# Altium schematic sheet AIM2 - GPS REVB.SchDoc: OEM716 Interface
size B; DrawnBy: DJW; DocumentNumber: 9; SheetNumber: 9; SheetTotal: 12
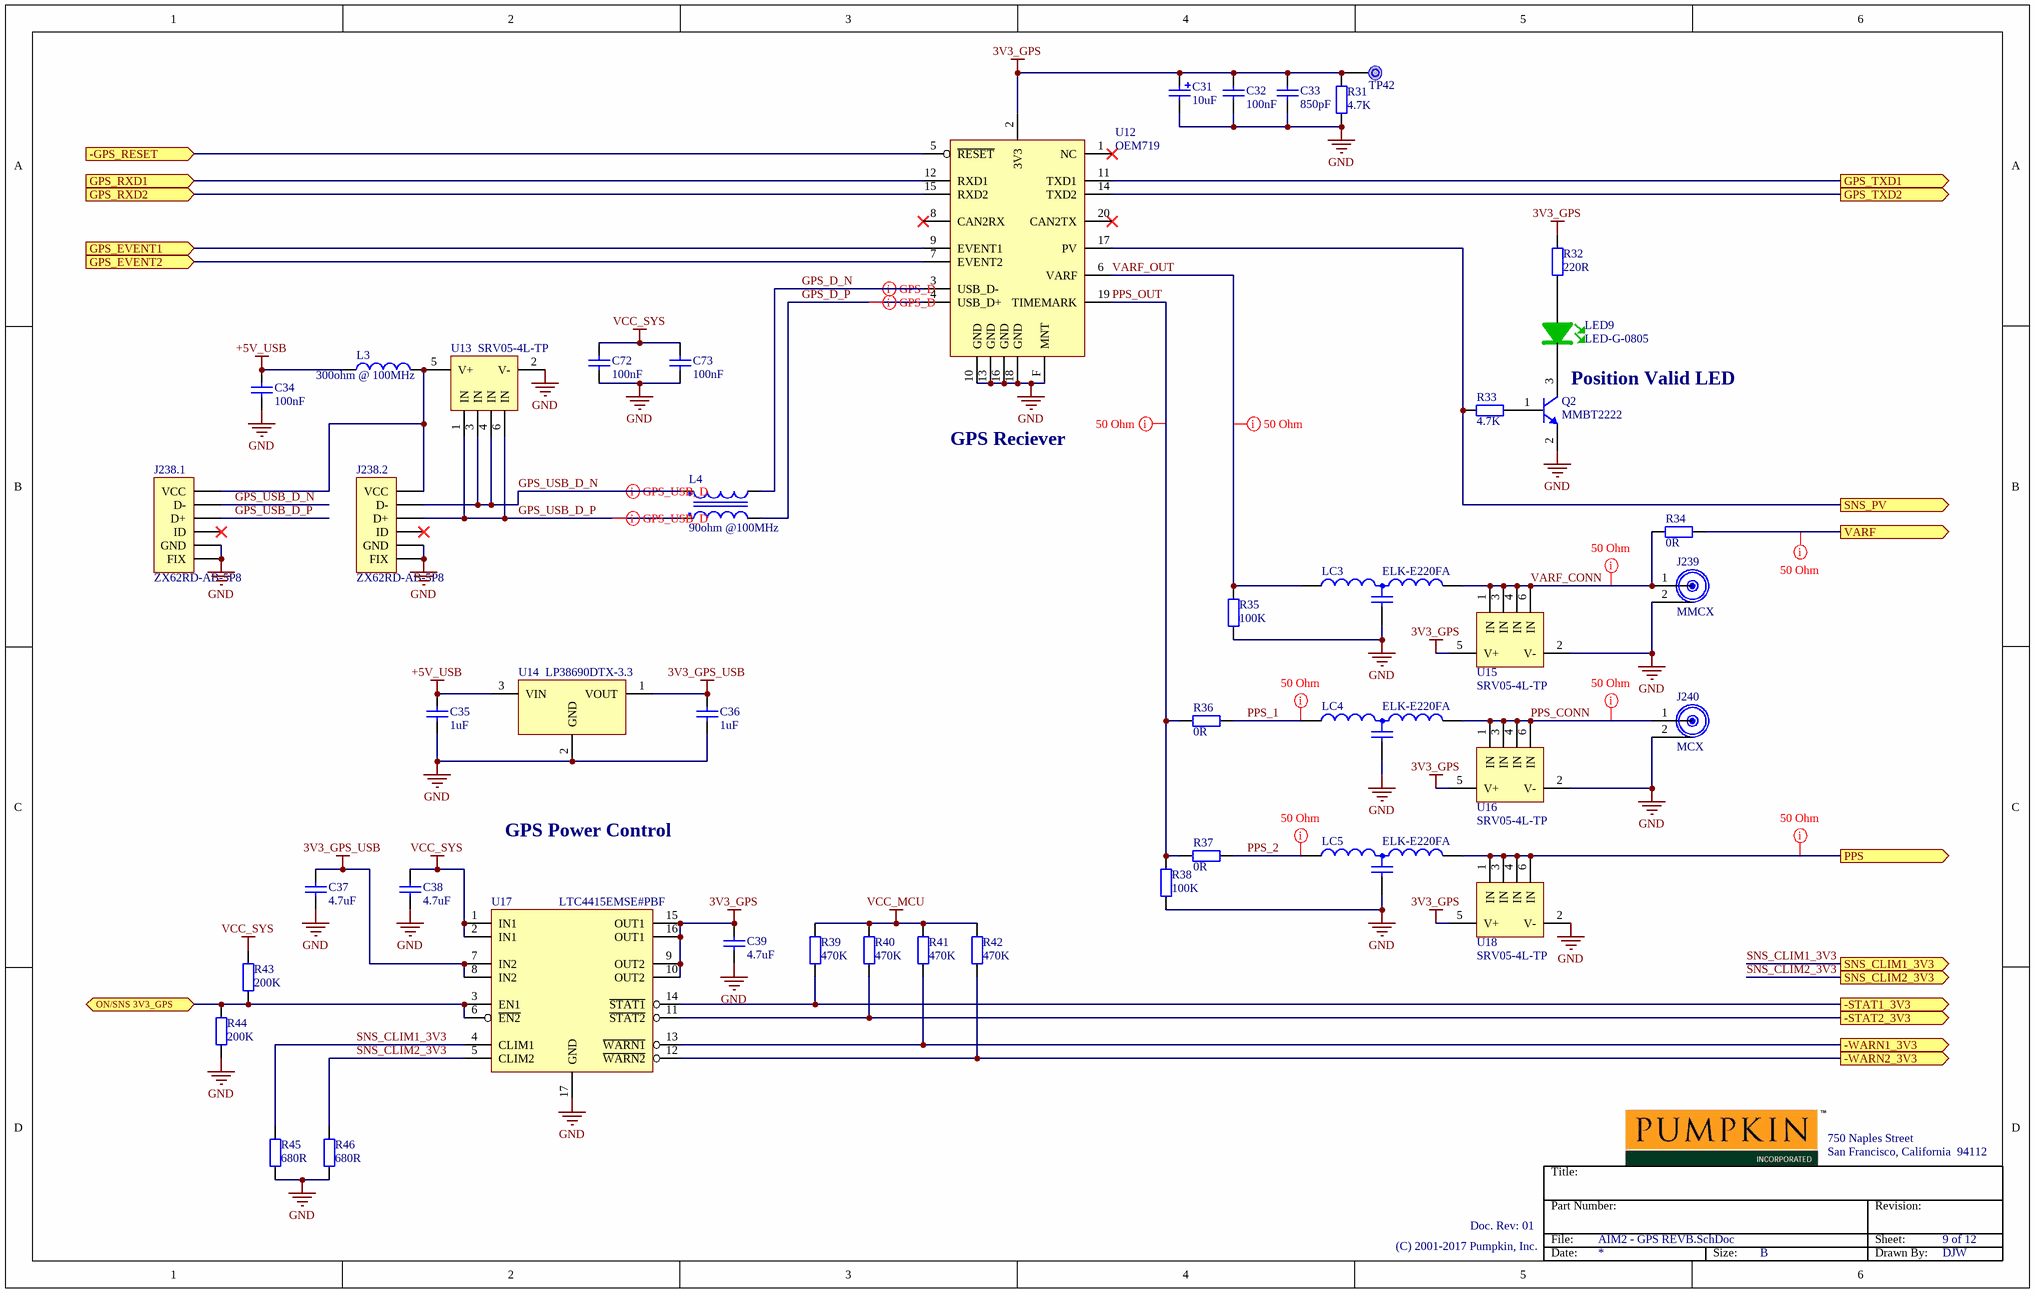
[diagram p0: AIM2 - GPS REVB.SchDoc]

## Parts
C31  10uF  [6032 POLAR CAP]
C32  100nF  [0603 CAP]
C33  850pF  [0603 CAP]
C34  100nF  [0603 CAP]
C35  1uF  [0805 CAP]
C36  1uF  [0805 CAP]
C37  4.7uF  [0805 CAP]
C38  4.7uF  [0805 CAP]
C39  4.7uF  [0805 CAP]
C72  100nF  [0603 CAP]
C73  100nF  [0603 CAP]
J238.1  ZX62RD-AB-5P8  [SM$5C$ZX62RD-AB-5P8]
J238.2  ZX62RD-AB-5P8  [SM$5C$ZX62RD-AB-5P8]
J239  MMCX  [mmcx]
J240  MCX  [MCX]
L3  300ohm @ 100MHz  [0603 IND]
L4  90ohm @100MHz  [DFN250P320X200-4N]
LC3  ELK-E220FA  [ELK]
LC4  ELK-E220FA  [ELK]
LC5  ELK-E220FA  [ELK]
LED9  LED-G-0805  [0805 LED-GREEN]
Q2  MMBT2222  [SOT23-3]
R31  4.7K  [0805 RES]
R32  220R  [0805 RES]
R33  4.7K  [0805 RES]
R34  0R  [0805 RES]
R35  100K  [0805 RES]
R36  0R  [0805 RES]
R37  0R  [0805 RES]
R38  100K  [0805 RES]
R39  470K  [0805 RES]
R40  470K  [0805 RES]
R41  470K  [0805 RES]
R42  470K  [0805 RES]
R43  200K  [0805 RES]
R44  200K  [0805 RES]
R45  680R  [0805 RES]
R46  680R  [0805 RES]
TP42  Testpoint  [Testpoint]  (value not drawn)  (no BOM)
U12  OEM719  [OEM719]
U13  SRV05-4L-TP  [SOT23-6]
U14  LP38690DTX-3.3  [DPAK]
U15  SRV05-4L-TP  [SOT23-6]
U16  SRV05-4L-TP  [SOT23-6]
U17  LTC4415EMSE#PBF  [MSOP-16]
U18  SRV05-4L-TP  [SOT23-6]

## Ports
-GPS_RESET (in), -STAT1_3V3 (out), -STAT2_3V3 (out), -WARN1_3V3 (out), -WARN2_3V3 (out), GPS_EVENT1 (in), GPS_EVENT2 (in), GPS_RXD1 (in), GPS_RXD2 (in), GPS_TXD1 (out), GPS_TXD2 (out), ON/SNS 3V3_GPS (bidir), PPS (out), SNS_CLIM1_3V3 (out), SNS_CLIM2_3V3 (out), SNS_PV (out), VARF (out)

## Nets
3V3_GPS: C31.1 C32.2 C33.2 C39.2 R31.2 R32.2 TP42.1 U12.2(3V3) U15.5(V+) U16.5(V+) U17.9(OUT2) U17.10(OUT2) U17.15(OUT1) U17.16(OUT1) U18.5(V+)
3V3_GPS_USB: C36.2 C37.2 U14.1(VOUT) U17.7(IN2) U17.8(IN2)
+5V_USB: C34.2 C35.2 L3.1 U14.3(VIN)
GND: C31.2 C32.1 C33.1 C34.1 C35.1 C36.1 C37.1 C38.1 C39.1 C72.1 C73.1 J238.1.5(GND) J238.1.F(FIX) J238.2.5(GND) J238.2.F(FIX) J239.2 J240.2 LC3.2 LC4.2 LC5.2 Q2.2(E) R31.1 R35.1 R38.1 R44.1 R45.1 R46.1 U12.10(GND) U12.13(GND) U12.16(GND) U12.18(GND) U12.F(MNT) U13.2(V-) U14.2(GND) U15.2(V-) U16.2(V-) U17.17(GND) U18.2(V-)
VCC_MCU: R39.2 R40.2 R41.2 R42.2
VCC_SYS: C38.2 C72.2 C73.2 R43.2 U17.1(IN1) U17.2(IN1)
-GPS_RESET: U12.5(~{RESET}) ; port -GPS_RESET
-STAT1_3V3: R39.1 U17.14(~{STAT1}) ; port -STAT1_3V3
-STAT2_3V3: R40.1 U17.11(~{STAT2}) ; port -STAT2_3V3
-WARN1_3V3: R41.1 U17.13(~{WARN1}) ; port -WARN1_3V3
-WARN2_3V3: R42.1 U17.12(~{WARN2}) ; port -WARN2_3V3
GPS_D_N: L4.2 U12.3(USB_D-)
GPS_D_P: L4.3 U12.4(USB_D+)
GPS_EVENT1: U12.9(EVENT1) ; port GPS_EVENT1
GPS_EVENT2: U12.7(EVENT2) ; port GPS_EVENT2
GPS_RXD1: U12.12(RXD1) ; port GPS_RXD1
GPS_RXD2: U12.15(RXD2) ; port GPS_RXD2
GPS_TXD1: U12.11(TXD1) ; port GPS_TXD1
GPS_TXD2: U12.14(TXD2) ; port GPS_TXD2
GPS_USB_D_N: J238.1.2(D-) J238.2.2(D-) L4.1 U13.3(IN) U13.4(IN)
GPS_USB_D_P: J238.1.3(D+) J238.2.3(D+) L4.4 U13.1(IN) U13.6(IN)
ON/SNS 3V3_GPS: R43.1 R44.2 U17.3(EN1) U17.6(~{EN2}) ; port ON/SNS 3V3_GPS
PPS: LC5.3 U18.1(IN) U18.3(IN) U18.4(IN) U18.6(IN) ; port PPS
PPS_1: LC4.1 R36.2
PPS_2: LC5.1 R37.2
PPS_CONN: J240.1 LC4.3 U16.1(IN) U16.3(IN) U16.4(IN) U16.6(IN)
PPS_OUT: R36.1 R37.1 R38.2 U12.19(TIMEMARK)
SNS_CLIM1_3V3: R45.2 U17.4(CLIM1) ; port SNS_CLIM1_3V3
SNS_CLIM2_3V3: R46.2 U17.5(CLIM2) ; port SNS_CLIM2_3V3
SNS_PV: R33.1 U12.17(PV) ; port SNS_PV
VARF: R34.2 ; port VARF
VARF_CONN: J239.1 LC3.3 R34.1 U15.1(IN) U15.3(IN) U15.4(IN) U15.6(IN)
VARF_OUT: LC3.1 R35.2 U12.6(VARF)
NetJ238.1_1: J238.1.1(VCC) J238.2.1(VCC) L3.2 U13.5(V+)
NetLED9_1: LED9.1 Q2.3(C)
NetLED9_2: LED9.2 R32.1
NetQ2_1: Q2.1(B) R33.2

Not connected (* = marked no-connect by the designer): J238.1 4(ID)*; J238.2 4(ID)*; U12 1(NC)* 8(CAN2RX)* 20(CAN2TX)*

## Layout directives
differential pair; rule Matched Net Lengths [Tolerance = 10mil]; net class Diff Pairs: GPS_D_N, GPS_D_P, GPS_USB_D_N, GPS_USB_D_P
net class 50 Ohm: PPS, PPS_1, PPS_2, PPS_CONN, PPS_OUT, VARF, VARF_CONN, VARF_OUT

## Notes on the sheet
- (near Q2) Position Valid LED
- GPS Reciever
- GPS Power Control
- Title:
- 750 Naples Street
- San Francisco, California  94112
- Doc. Rev: 01
- File:
- Part Number:
- Revision:
- Sheet:
- (C) 2001-2017 Pumpkin, Inc.
- Date:
- Size:
- B
- Drawn By:

## Library data of the parts
C31 = Capacitor 10uF 6032 Tantalum: Capacitor 10uF 6032 TANT 16V 10%; Value: 10uF; Supplier 1: Digi-Key; Supplier Part Number 1: 399-3732-1-ND
C32 C34 C72 C73 = Capacitor 100nF 0603: Capacitor 100nF 0603 X7R 50V 5%; Value: 100nF; Supplier 1: Digi-Key; Supplier Part Number 1: 399-7844-1-ND
C33 = Capacitor 850pF 0603: Capacitor 850pF 0603 100V; Value: 850pF; Supplier 1: Digi-Key; Supplier Part Number 1: 1761-1075-1-ND
C35 C36 = Capacitor 1uF 0805: Capacitor 1uF 0805 X7R 25V 10%; Value: 1uF; Supplier 1: Digi-Key; Supplier Part Number 1: 445-5687-1-ND
C37-C39 = Capacitor 4.7uF 0805: Capacitor 4.7uF 0805 X7R 35V 10%; Value: 4.7uF; Supplier 1: Digi-Key; Supplier Part Number 1: 445-172479-1-ND
J238.1 J238.2 = ZX62RD-AB-5P8: Header USB Micro AB; Supplier 1: Digi-Key; Supplier Part Number 1: H11611CT-ND
J239 = MMCX: Header MMCX Through-hole vertical; Supplier 1: Digi-Key; Supplier Part Number 1: WM9481-ND
J240 = MCX: Header MCX Through-hole vertical; Supplier 1: Digi-Key; Supplier Part Number 1: SAM8944-ND
L3 = Ferrite Bead 300ohm @ 100MHz: Revision: July-2002: Re-released for DXP Platform.; Value: 300ohm @ 100MHz; Supplier 1: Digi-Key; Supplier Part Number 1: 732-1592-1-ND
L4 = Choke 90ohm @ 100MHz: Choke Common-mode 90ohm @ 100MHz; Supplier 1: Digi-Key; Supplier Part Number 1: 732-1469-1-ND
LC3-LC5 = LC Filter: Filter LC 100MHz; Supplier 1: Digi-Key; Supplier Part Number 1: P9871DKR-ND
LED9 = LED GREEN 0805: Supplier 1: Digi-Key; Supplier Part Number 1: 160-1414-1-ND
Q2 = MMBT2222ALT1GOSCT-ND: Transistor NPN; Supplier 1: Digi-Key; Supplier Part Number 1: MMBT2222ALT1GOSCT-ND
R31 R33 = Resistor 4K7 0805: Resistor 4.7K 0805 0.125W 1%; Revision: Altium ETH 11-03.2008; Value: 4.7K; Supplier 1: Digi-Key; Supplier Part Number 1: 311-4.70KCRCT-ND
R32 = Resistor 220R 0805: Resistor 220R 0805 0.125W 1%; Revision: Altium ETH 11-03.2008; Value: 220R; Supplier 1: Digi-Key; Supplier Part Number 1: P220CCT-ND
R34 R36 R37 = Resistor 0R 0805: Resistor 0R 0805 0.125W; Revision: Altium ETH 11-03.2008; Value: 0R; Supplier 1: Digi-Key; Supplier Part Number 1: P0.0ACT-ND
R35 R38 = Resistor 100K 0805: Resistor 100K 0805 0.5W 1%; Revision: Altium ETH 11-03.2008; Value: 100K; Supplier 1: Digi-Key; Supplier Part Number 1: P16060CT-ND
R39-R42 = Resistor 470K 0805: Resistor 470K 0805 0.125W 0.1%; Revision: Altium ETH 11-03.2008; Value: 470K; Supplier 1: Digi-Key; Supplier Part Number 1: P470KDACT-ND
R43 R44 = Resistor 200K 0805: Resistor 200K 0805 0.125W 1%; Revision: Altium ETH 11-03.2008; Value: 200K; Supplier 1: Digi-Key; Supplier Part Number 1: P200KCCT-ND
R45 R46 = Resistor 680R 0805: Resistor 470K 0805 0.125W 1%; Revision: Altium ETH 11-03.2008; Value: 680R; Supplier 1: Digi-Key; Supplier Part Number 1: 311-680CRCT-ND
U12 = OEM719: GPS Reciever; Supplier 1: Digi-Key; Supplier Part Number 1: SAM12500-ND
U13 U15 U16 U18 = SRV05-4L-TP: IC ESD protection 4 input; Supplier 1: Digi-Key; Supplier Part Number 1: SRV05-4L-TPMSCT-ND
U14 = LP38690DTX-3.3: Regulator 3.3V LDO; Supplier 1: Digi-Key; Supplier Part Number 1: LP38690DTX-3.3/NOPBCT-ND
U17 = LTC4415: IC Driver Dual Idewal Diode; Supplier 1: Digi-Key; Supplier Part Number 1: LTC4415EMSE#PBF-ND